# EAGLE design M_C_ext_esp32_cp2102 (EAGLE 9.6.2)
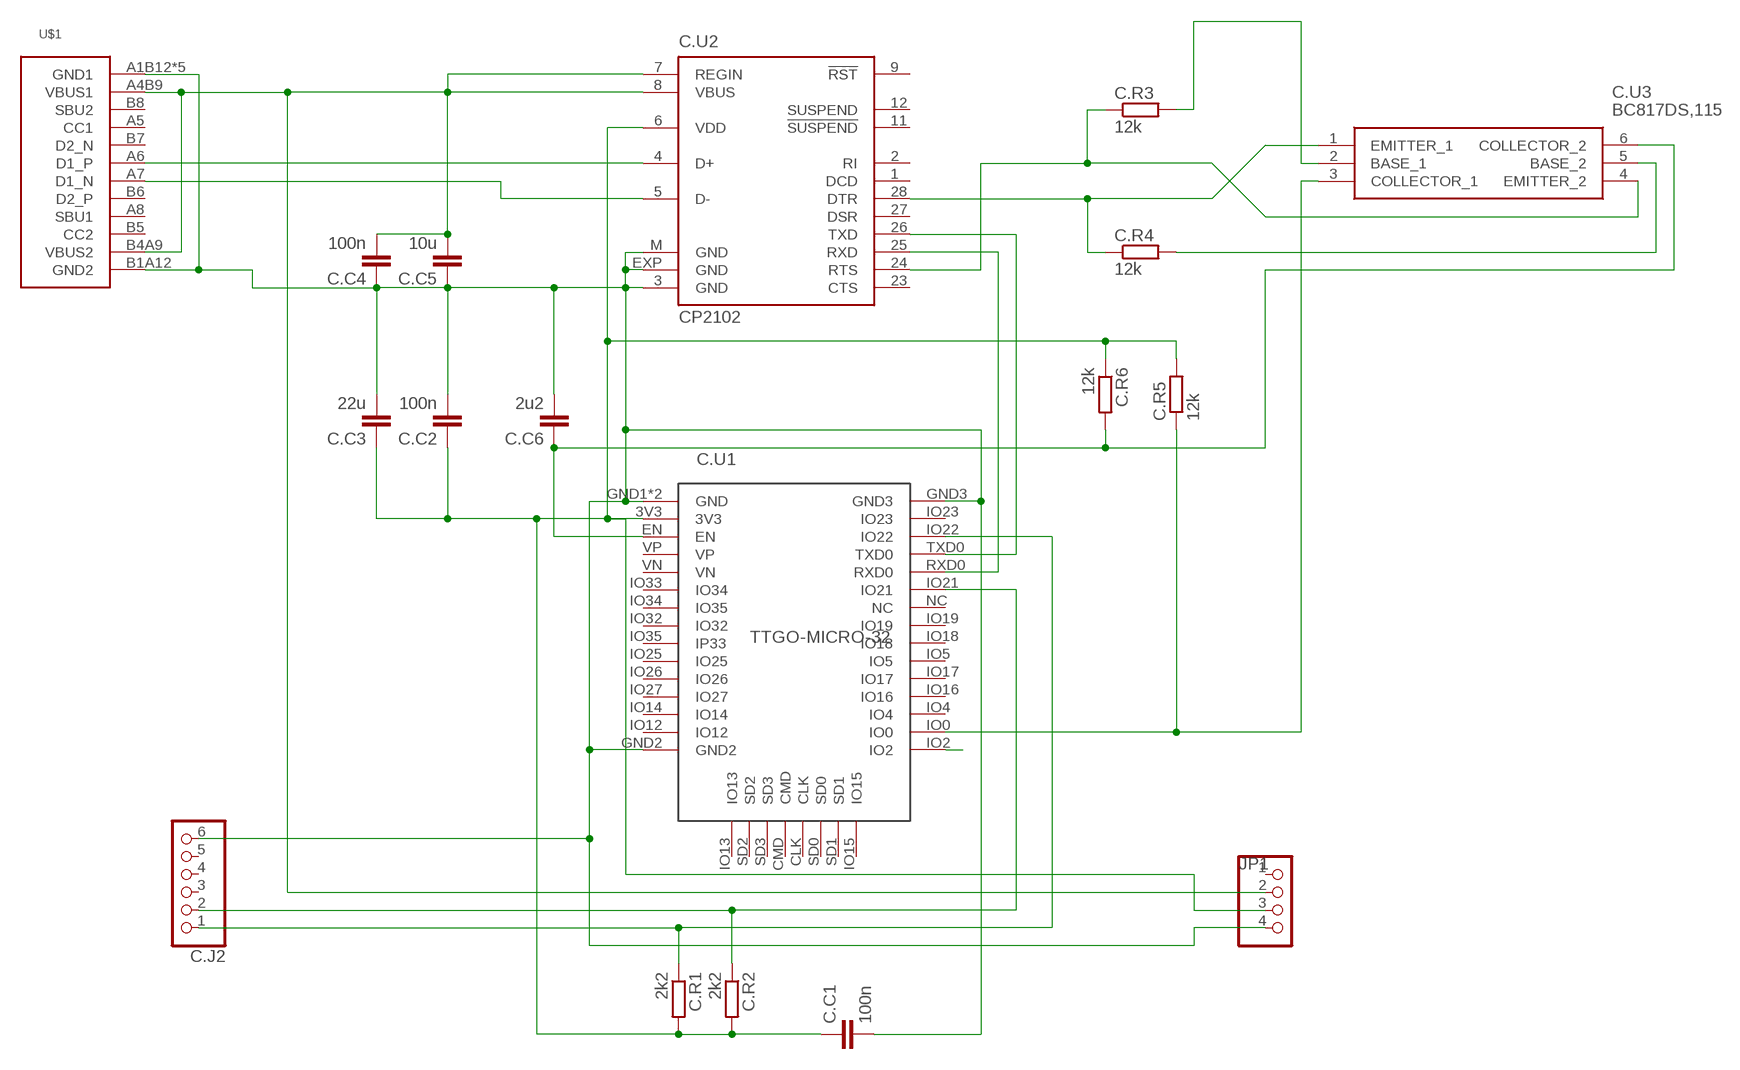
[diagram p0: schematic, sheet 1]

## Parts
C.C1  100n  C-EUC0603  [C0603]
C.C2  100n  C-EUC0603  [C0603]
C.C3  22u  C-EUC0805  [C0805]
C.C4  100n  C-EUC0603  [C0603]
C.C5  10u  C-EUC0603  [C0603]
C.C6  2u2  C-EUC0603  [C0603]
C.J2  PINHD-1X6  [1X06]
C.R1  2k2  R-EU_R0603  [R0603]
C.R2  2k2  R-EU_R0603  [R0603]
C.R3  12k  R-EU_R0603  [R0603]
C.R4  12k  R-EU_R0603  [R0603]
C.R5  12k  R-EU_R0603  [R0603]
C.R6  12k  R-EU_R0603  [R0603]
C.U1  TTGO-MICRO-32  [TTGO-MICRO-32]
C.U2  CP2102  [MLP28]
C.U3  BC817DS,115  [SOT95P275X110-6N]
JP1  PINHD-1X4  [1X04]
U$1  USB-C  [USB-C]

## Nets
GND: C.C1.2 C.C2.2 C.C3.2 C.C4.1 C.C5.1 C.C6.2 C.J2.6 C.U1.GND1(GND) C.U1.GND2 C.U1.GND3 C.U1.GND4(GND) C.U2.3(GND) C.U2.EXP(GND) C.U2.M(GND) JP1.4 U$1.A1B12(GND1) U$1.B1A12(GND2) U$1.SH1(GND1) U$1.SH2(GND1) U$1.SH3(GND1) U$1.SH4(GND1)
N$1: C.U2.5(D-) U$1.A7(D1_N)
N$2: C.U2.4(D+) U$1.A6(D1_P)
N$5: C.R4.2 C.U3.5(BASE_2)
N$7: C.R3.2 C.U3.2(BASE_1)
N$8: C.R3.1 C.U2.24(RTS) C.U3.4(EMITTER_2)
N$9: C.R4.1 C.U2.28(DTR) C.U3.1(EMITTER_1)
N$10: C.R5.1 C.U1.IO0 C.U3.3(COLLECTOR_1)
N$11: C.C6.1 C.R6.2 C.U1.EN C.U3.6(COLLECTOR_2)
N$13: C.U1.IO2
RX: C.U1.RXD0 C.U2.25(RXD)
SCL: C.J2.1 C.R1.1 C.U1.IO22
SDA: C.J2.2 C.R2.1 C.U1.IO21
TX: C.U1.TXD0 C.U2.26(TXD)
VDD: C.C1.1 C.C2.1 C.C3.1 C.R1.2 C.R2.2 C.R5.2 C.R6.1 C.U1.3V3 C.U2.6(VDD) JP1.3
VUSB: C.C4.2 C.C5.2 C.U2.7(REGIN) C.U2.8(VBUS) JP1.2 U$1.A4B9(VBUS1) U$1.B4A9(VBUS2)
Unconnected: C.J2.3 C.J2.4 C.J2.5 C.U1.CLK C.U1.CMD C.U1.IO4 C.U1.IO5 C.U1.IO12 C.U1.IO13 C.U1.IO14 C.U1.IO15 C.U1.IO16 C.U1.IO17 C.U1.IO18 C.U1.IO19 C.U1.IO23 C.U1.IO25 C.U1.IO26 C.U1.IO27 C.U1.IO32 C.U1.IO33(IO34) C.U1.IO34(IO35) C.U1.IO35(IP33) C.U1.NC C.U1.SD0 C.U1.SD1 C.U1.SD2 C.U1.SD3 C.U1.VN C.U1.VP C.U2.1(DCD) C.U2.2(RI) C.U2.9(!RST) C.U2.11(!SUSPEND) C.U2.12(SUSPEND) C.U2.23(CTS) C.U2.27(DSR) JP1.1 U$1.A5(CC1) U$1.A8(SBU1) U$1.B5(CC2) U$1.B6(D2_P) U$1.B7(D2_N) U$1.B8(SBU2)

## Library data of the parts
C.C1-C.C6 = rcl:C-EU: CAPACITOR, European symbol; SPICEPREFIX: C
C.J2 = pinhead2:PINHD-1X6: PIN HEADER
C.R1-C.R6 = rcl:R-EU_: RESISTOR, European symbol; SPICEPREFIX: R
C.U1 = hugo:TTGO-MICRO-32
C.U2 = silabs:CP210*: Single-Chip USB to UART Bridge Source: www.silabs.com .. CP2101.pdf / cp2102.pdf; MF: FARNELL; MPN: CP2102-GM; OC_FARNELL: 9282130; OC_NEWARK: 30K5635
C.U3 = SamacSys_Parts:BC817DS,115: Nexperia BC817DS,115 Dual NPN Transistor, 500 mA, 45 V, 6-Pin TSOP Source: Datasheet <https://assets.nexperia.com/documents/data-sheet/BC817DS.pdf>; DESCRIPTION: Nexperia BC817DS,115 Dual NPN Transistor, 500 mA, 45 V, 6-Pin TSOP; HEIGHT: 1.1mm; MANUFACTURER_NAME: Nexperia; MANUFACTURER_PART_NUMBER: BC817DS,115; MOUSER_PART_NUMBER: 771-BC817DS115; MOUSER_PRICE-STOCK: https://www.mouser.co.uk/ProductDetail/Nexperia/BC817DS115?qs=me8TqzrmIYURqlgr%252Br8f7Q%3D%3D
JP1 = pinhead2:PINHD-1X4: PIN HEADER
U$1 = hugo:USB-C

## Board
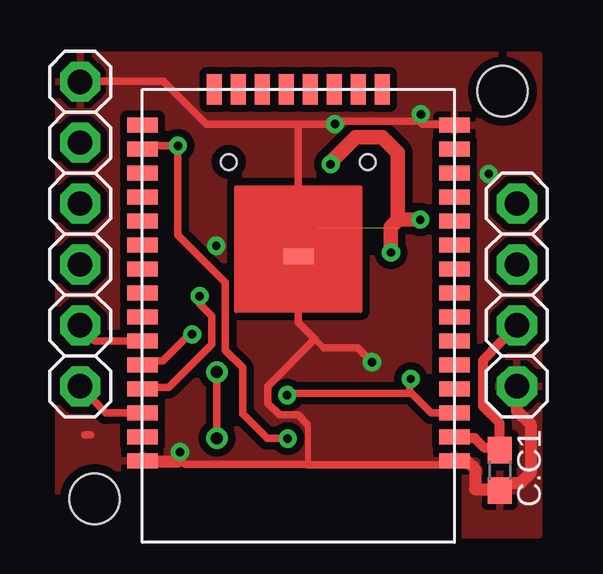
[diagram p1: board, top side]
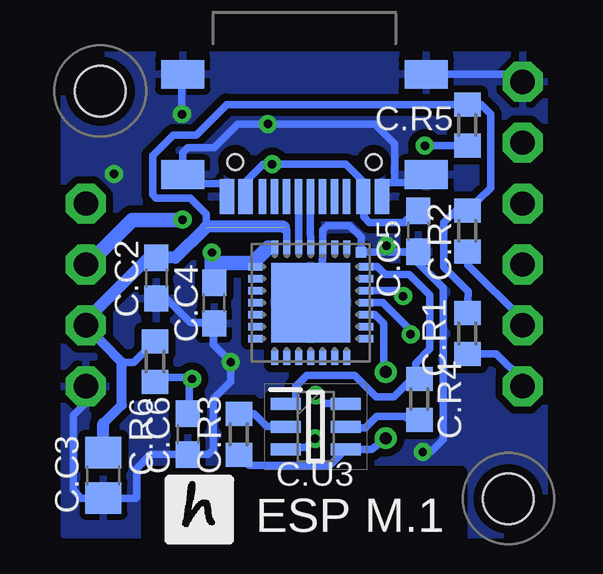
[diagram p2: board, bottom side, seen from below]

No outline drawn. Coordinates in mm, seen from the top.
Copper layers (1*16): Top 0.035mm / dielectric 1.5mm / Bottom 0.035mm
Design rules "default *": minimum track width 10mil, minimum drill 0.35mm, track to track 6mil, track to pad 10mil, pad to pad 6mil, via to via 10mil, smd to smd 10mil, copper to edge 15mil, drill to drill 40mil, minimum pad ring 10mil, minimum via ring 8mil, stop-mask expansion 4mil, vias tented up to drill 0mil, thermal gap 10mil
Holes 2.1 mm at 2,2 19,19

### Footprints (pad centres in the part's own frame; a part is rotated, then mirrored left to right if it is on the bottom)
C0603 = smd 1.1 x 1: 1 -0.85,0; 2 0.85,0
C0805 = smd 1.3 x 1.5: 1 -0.95,0; 2 0.95,0
1X06 = drill 1.016 pad 1.676 octagon: 1 -6.35,0; 2 -3.81,0; 3 -1.27,0; 4 1.27,0; 5 3.81,0; 6 6.35,0
R0603 = smd 1 x 1.1: 1 -0.85,0; 2 0.85,0
TTGO-MICRO-32 = smd 1.27 x 0.635: 3V3 -6.5,5; EN -6.5,4; GND1 -6.5,6; GND2 -6.5,-8; GND3 6.5,6; GND4 0,-2.54; IO0 6.5,-7; IO2 6.5,-8; IO4 6.5,-6; IO5 6.5,-3; IO12 -6.5,-7; IO14 -6.5,-6; IO16 6.5,-5; IO17 6.5,-4; IO18 6.5,-2; IO19 6.5,-1; IO21 6.5,1; IO22 6.5,4; IO23 6.5,5; IO25 -6.5,-3; IO26 -6.5,-4; IO27 -6.5,-5; IO32 -6.5,-1; IO33 -6.5,-2; IO34 -6.5,1; IO35 -6.5,0; NC 6.5,0; RXD0 6.5,2; TXD0 6.5,3; VN -6.5,2; VP -6.5,3 | smd 0.635 x 1.27: CLK 0.5,-9.5; CMD -0.5,-9.5; IO13 -3.5,-9.5; IO15 3.5,-9.5; SD0 1.5,-9.5; SD1 2.5,-9.5; SD2 -2.5,-9.5; SD3 -1.5,-9.5
MLP28 = smd 0.6 x 0.3: 1 -2.3,1.5; 2 -2.3,1; 3 -2.3,0.5; 4 -2.3,0; 5 -2.3,-0.5; 6 -2.3,-1; 7 -2.3,-1.5; 15 2.3,-1.5; 16 2.3,-1; 17 2.3,-0.5; 18 2.3,0; 19 2.3,0.5; 20 2.3,1; 21 2.3,1.5 | smd 0.3 x 0.6: 8 -1.5,-2.3; 9 -1,-2.3; 10 -0.5,-2.3; 11 0,-2.3; 12 0.5,-2.3; 13 1,-2.3; 14 1.5,-2.3; 22 1.5,2.3; 23 1,2.3; 24 0.5,2.3; 25 0,2.3; 26 -0.5,2.3; 27 -1,2.3; 28 -1.5,2.3 | smd 3.3 x 3.3: EXP 0,0 | smd 0.435 x 0.435: M -2.103,2.103
SOT95P275X110-6N = smd 1.25 x 0.5: 1 -1.25,0.95; 2 -1.25,0; 3 -1.25,-0.95; 4 1.25,-0.95; 5 1.25,0; 6 1.25,0.95
1X04 = drill 1.016 pad 1.676 octagon: 1 -3.81,0; 2 -1.27,0; 3 1.27,0; 4 3.81,0
USB-C = smd 0.6 x 1.45: A1B12 -3.235,3.825; A4B9 -2.46,3.825; B1A12 3.215,3.825; B4A9 2.44,3.825 | smd 0.3 x 1.45: A5 -1.26,3.825; A6 -0.26,3.825; A7 0.24,3.825; A8 1.24,3.825; B5 1.74,3.825; B6 0.74,3.825; B7 -0.76,3.825; B8 -1.76,3.825 | smd 1.8 x 1.2: SH1 -5.08,2.91; SH2 -5.08,-1.27; SH3 5.06,-1.27; SH4 5.06,2.91 | hole 0.65: 2.88,2.38; -2.9,2.38

### Placement (x,y rotation side)
C.C1  18.88,3.19 270 top
C.C2  16.66,11.2 270 bottom
C.C3  18.87,2.98 270 bottom
C.C4  14.26,10.16 90 bottom
C.C5  5.74,13.16 90 bottom
C.C6  15.36,4.69 270 bottom
C.J2  1.4,13.04 90 top
C.R1  3.7,8.9 90 bottom
C.R2  3.7,13.17 90 bottom
C.R3  13.22,4.68 90 bottom
C.R4  5.7,6.15 270 bottom
C.R5  3.7,17.59 90 bottom
C.R6  16.72,7.72 270 bottom
C.U1  10.49,9.58 180 top
C.U2  10.23,10.18 270 bottom
C.U3  10.03,5 0 bottom
JP1  19.6,10.5 270 top
U$1  10.5,18.43 180 bottom

### Tracks (layer width: path | path; a pad name or v marks a point on that pad's centre or on a via)
GND  (via drill 0.35)
  Top 0.254: 10.84,5.13 10.88,5.09 10.88,3.44 10.88,3.41 | 11.54,8.29 11.18,8.65
  Top 0.305: C.U1.GND2 16.94,17.63 15.65,17.63 15.6,17.68 v15.6,18.03 15.6,17.75 12.14,17.75 v12.01,17.63 10.49,17.63 | 5.48,3.55 5.56,3.63 v5.56,3.95 5.56,3.66 5.78,3.44 10.88,3.44 | C.U1.GND3 4.02,3.55 | C.J2.6 1.43,19.42 4.86,19.42 6.66,17.63 10.49,17.63 | C.U1.GND1 16.82,3.41 10.88,3.41 | C.U1.GND4 10.11,12.12 | 10.49,17.63 C.U1.GND4 | C.U1.GND4 10.49,9.35 11.18,8.65 9.21,6.68 9.21,5.99 9.71,5.49 10.48,5.49 10.84,5.13 | v13.56,7.7 12.97,8.29 11.54,8.29 | C.C1.2 18.88,2.52 | 1.84,4.67 1.6,4.67
  Top 0.508: 5.48,3.55 4.02,3.55 | JP1.4 19.6,5.68 20.17,5.11 20.17,3.06 19.74,2.63 18.88,2.63 C.C1.2 18.82,2.4 17.86,2.4 17.86,3.24 17.54,3.56 17.01,3.56 C.U1.GND1
  Bottom 0.254: C.C6.2 15.52,3.68
  Bottom 0.305: C.U2.EXP 9.77,10.68 C.U2.3 9.73,13.21 9.54,13.4 8.62,13.4 8.13,12.91 C.U2.M 5.77,12.28 C.C5.1 5.74,11.82 4.71,10.79 4.71,4.47 5.23,3.95 v5.56,3.95 | 15.58,18.03 v15.6,18.03 15.6,19.66 U$1.SH3 | v13.56,7.7 14.3,8.43 14.3,9.27 C.C4.1 14.3,9.35 15.24,9.35 16.24,10.35 C.C2.2 | 13.8,7.7 v13.56,7.7 | 6.02,15.21 5.72,15.21 U$1.SH1 5.75,15.19 7.26,15.19 | U$1.A1B12 7.26,15.19 | 7.26,15.19 7.26,15.21 | U$1.SH4 15.56,16.43 15.36,16.64 14.25,16.64 13.27,17.62 12.02,17.62 v12.01,17.63 7.57,17.63 6.73,16.79 6.73,15.24 | U$1.SH2 1.75,19.7 C.J2.6 | 15.32,3.88 C.C6.2 | 18.87,1.95 | C.C3.2 18.87,1.95 | 15.32,15.52 U$1.SH4 | U$1.SH4 15.18,15.14 13.82,15.14 13.71,15.04 U$1.B1A12 | C.C6.2 14.49,3.84 14.29,4.04 14.29,6.16 13.56,6.89 v13.56,7.7 | 15.71,3.84 C.C6.2 | C.C3.2 17.53,2.03 17.49,2.07 17.49,3.28 16.92,3.84 C.C6.2 | C.C3.2 19.79,2.03 20.13,2.37 20.13,5.47 19.6,6 JP1.4
  other vias: 7.07,12.55 18.43,15.54
  pour Top (isolate 0.305): 0.5,0.5 0.5,20.5 20.5,20.5 20.5,0.5
  pour Bottom (isolate 0.305): 0.5,20.5 20.5,20.5 20.5,0.5 0.5,0.5
N$1
  Bottom 0.305: C.U2.5 U$1.A7
N$2
  Bottom 0.305: C.U2.4 10.23,12.9 10.24,13.05 10.24,13.06 U$1.A6
N$5
  Bottom 0.305: C.U3.5 8.74,4.96 7.95,4.96 7.48,5.44 6.21,5.44 6.21,5.36 C.R4.2
N$7
  Bottom 0.305: C.U3.2 11.29,5.02 12.07,5.02 12.59,5.54 C.R3.2
N$8  (via drill 0.5)
  Top 0.305: v7.1,7.28 | v7.1,7.28 7.09,7.27 v7.1,4.52
  Bottom 0.305: C.R3.1 12.79,3.4 9.44,3.4 C.U3.4 8.46,4.05 7.68,4.05 v7.1,4.52 | C.U2.24 7.55,9.68 7.18,9.31 7.18,7.41 v7.1,7.28
N$9
  Bottom 0.305: C.U3.1 11.06,5.95 10.86,6.16 10.86,6.67 10.39,7.14 8.4,7.14 7.51,6.25 6.76,6.25 6.02,7 C.R4.1 | C.R4.1 5.7,6.89 | C.R4.1 5.86,6.7 5.86,7.65 5.27,8.24 5.27,10.49 6.13,11.35 7.12,11.35 7.45,11.68 C.U2.28
N$10  (via drill 0.35)
  Top 0.305: C.U1.IO0 4.14,16.73 v5.47,16.73 v5.47,16.72 5.47,12.99 7.44,11.02 7.44,8.19 8.17,7.47 8.17,5.54 9.2,4.51 v10.05,4.51 9.99,4.51
  Bottom 0.305: v5.47,16.72 3.73,16.72 C.R5.1 | C.U3.3 11.19,4.14 10.41,4.14 v10.05,4.51 | v10.05,4.51
N$11  (via drill 0.35)
  Top 0.305: C.U1.EN 16.03,5.57 15.21,6.39 | 10.08,6.33 10.07,6.32 v10.03,6.32 10.09,6.39 15.21,6.39 | v15.18,7 15.14,7 15.14,6.48 15.21,6.4 15.21,6.39
  Bottom 0.305: 15.38,5.57 C.C6.1 15.29,5.61 15.29,6.88 v15.18,7 15.25,7.07 16.52,7.07 C.R6.2 | C.U3.6 8.79,5.97 9.67,5.97 v10.03,6.32
RX  (via drill 0.35)
  Top 0.305: v6.07,8.85 6.01,8.91 4.84,7.75 4.17,7.75 C.U1.RXD0
  Bottom 0.305: C.U2.25 7.24,10.18 5.99,8.93 v6.07,8.85
SCL
  Top 0.305: C.U1.IO22 2.47,5.58 C.J2.1
  Bottom 0.305: C.R1.1 2.5,8.05 1.4,6.95 C.J2.1
SDA
  Top 0.305: C.U1.IO21 2.01,8.58 C.J2.2
  Bottom 0.305: C.R2.1 3.68,11.75 1.4,9.47 C.J2.2
TX  (via drill 0.35)
  Top 0.305: C.U1.TXD0 4.06,6.65 5.1,6.65 6.88,8.43 6.88,9.61 6.38,10.11 v6.38,10.45
  Bottom 0.305: C.U2.26 6.61,10.68 v6.38,10.45
VDD  (1 unrouted)
  Top 0.305: C.C1.1 18.95,4.11
  Top 0.406: C.U1.3V3 17.04,4.53 17.85,4.53 18.25,4.12 18.77,4.12 18.86,4.04 C.C1.1 18.88,5.15 18.18,5.86 18.18,7.77 JP1.3
  Bottom 0.305: C.C3.1 18.87,4.43 | C.R2.2 3.62,14.02 | C.U2.6 11.23,13.21 11.36,13.35 | C.R2.2 2.73,14.96 2.73,18.04 3.13,18.44 C.R5.2 13.74,18.44 15,17.17 15.95,17.17 16.82,16.31 16.82,14.68 16.68,14.54 15.25,14.54 14.59,13.88 14.59,13.35 | C.R1.2 3.67,10.64 4.68,11.66 4.68,13.51 4.17,14.02 C.R2.2 | 16.66,12.2 C.C2.1 | 14.59,13.29 14.61,13.31 14.6,13.32 | C.R6.1 17.59,7.69 18.1,7.69
  Bottom 0.406: 18.87,5.13 18.1,5.91 18.1,7.69 JP1.3
  Bottom 0.508: 19.62,9.15 19.57,9.19 JP1.3 19.6,9.43 16.98,12.05 C.C2.1 15.87,12.05 14.61,13.31 | 11.34,13.31 11.34,13.32 11.36,13.35 14.59,13.35 | C.C3.1 18.87,5.13
VUSB  (via drill 0.35)
  Top 0.61: v11.84,15.95 11.84,16.04 12.88,17.09 13.98,17.09 14.63,16.43 14.63,13.64 14.66,13.64 | 14.66,13.64 14.35,13.34 v14.35,12.27 | v15.57,13.64 14.66,13.64
  Bottom 0.305: U$1.A4B9 8.1,14.55 | C.C5.2 5.85,14.01 6.29,13.57 6.29,13.52 7.78,13.52 8.02,13.76 8.02,14.59 U$1.A4B9 | U$1.A4B9 8.04,15.22 8.77,15.95 v11.84,15.95 12.21,15.95 12.92,15.24 12.92,14.95 12.94,14.93 U$1.B4A9 | v15.57,13.64 15.58,13.65 | JP1.2 19.57,11.73 | 14.1,11.48 14.02,11.41 14.02,10.77 C.C4.2 14.26,12.18 v14.35,12.27 | 13.99,11.83 14.35,11.47 | C.U2.7 12.01,12.48 | C.U2.8 12.53,11.83
  Bottom 0.406: 12.53,11.83 12.53,11.95
  Bottom 0.61: v15.57,13.64 15.58,13.63 17.67,13.63 19.57,11.73 | v14.35,12.27 14.35,11.47 | 13.99,11.83 12.53,11.83 | 12.01,12.48 12.53,11.95

### Text on the board
bPlace: ESP M.1